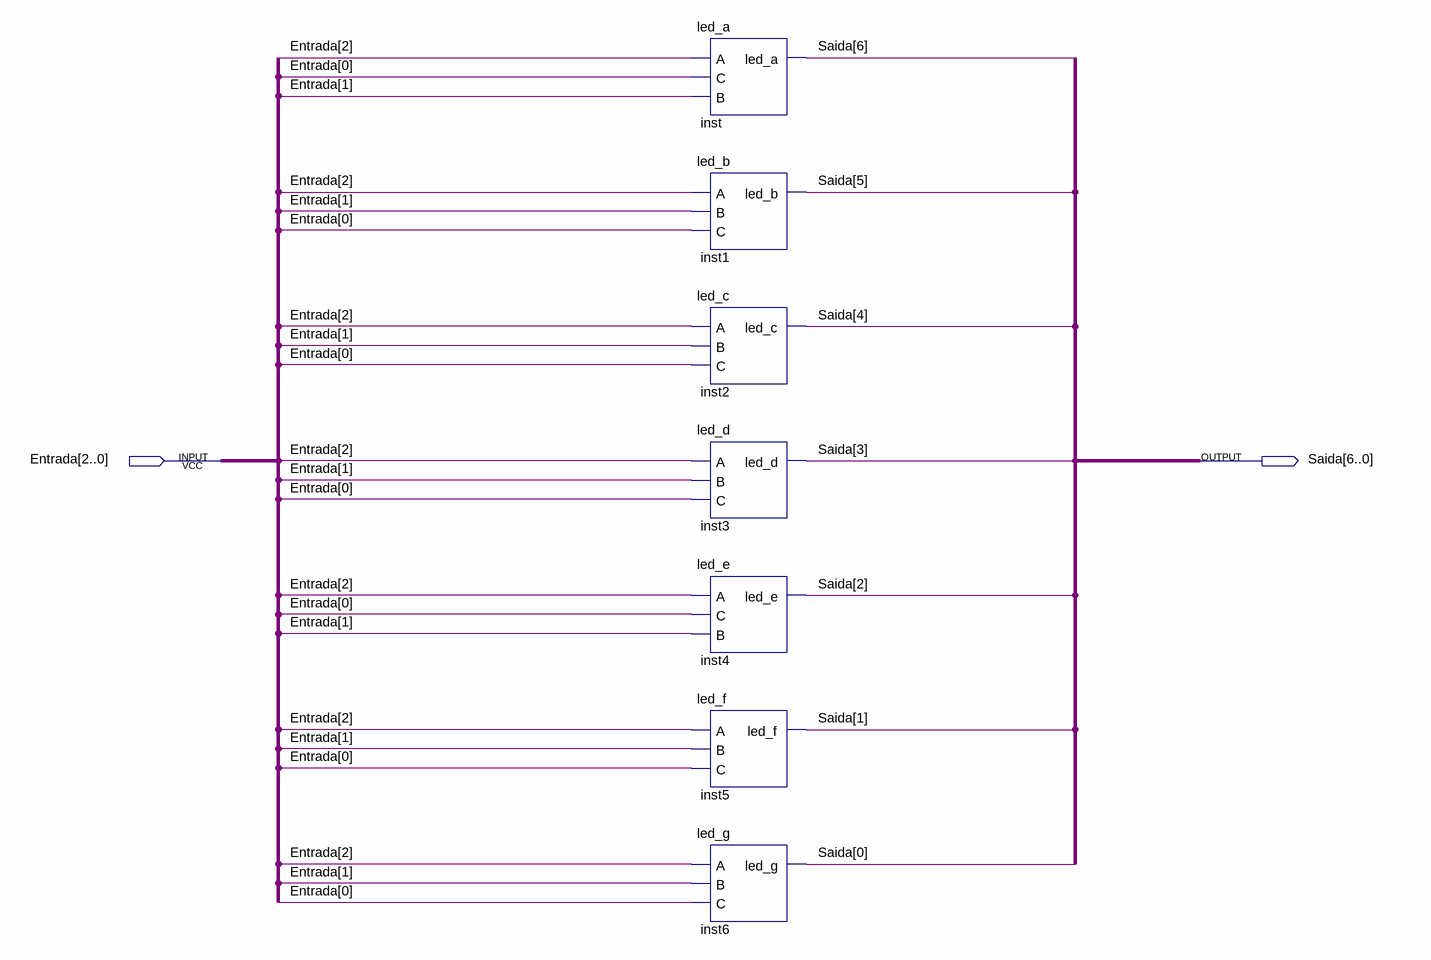
[diagram p0: schematic sheet]
// Quartus schematic display_ula.bdf as structural Verilog: 7 symbols, 2 pins
module display_ula (
  input  [2:0] Entrada,
  output [6:0] Saida
);

  led_a inst (.A(Entrada[2]), .C(Entrada[0]), .B(Entrada[1]), .led_a(Saida[6]));
  led_b inst1 (.A(Entrada[2]), .B(Entrada[1]), .C(Entrada[0]), .led_b(Saida[5]));
  led_c inst2 (.A(Entrada[2]), .B(Entrada[1]), .C(Entrada[0]), .led_c(Saida[4]));
  led_d inst3 (.A(Entrada[2]), .B(Entrada[1]), .C(Entrada[0]), .led_d(Saida[3]));
  led_e inst4 (.A(Entrada[2]), .C(Entrada[0]), .B(Entrada[1]), .led_e(Saida[2]));
  led_f inst5 (.A(Entrada[2]), .B(Entrada[1]), .C(Entrada[0]), .led_f(Saida[1]));
  led_g inst6 (.A(Entrada[2]), .B(Entrada[1]), .C(Entrada[0]), .led_g(Saida[0]));
endmodule
